# Altium project Nixie_clock.PrjPcb
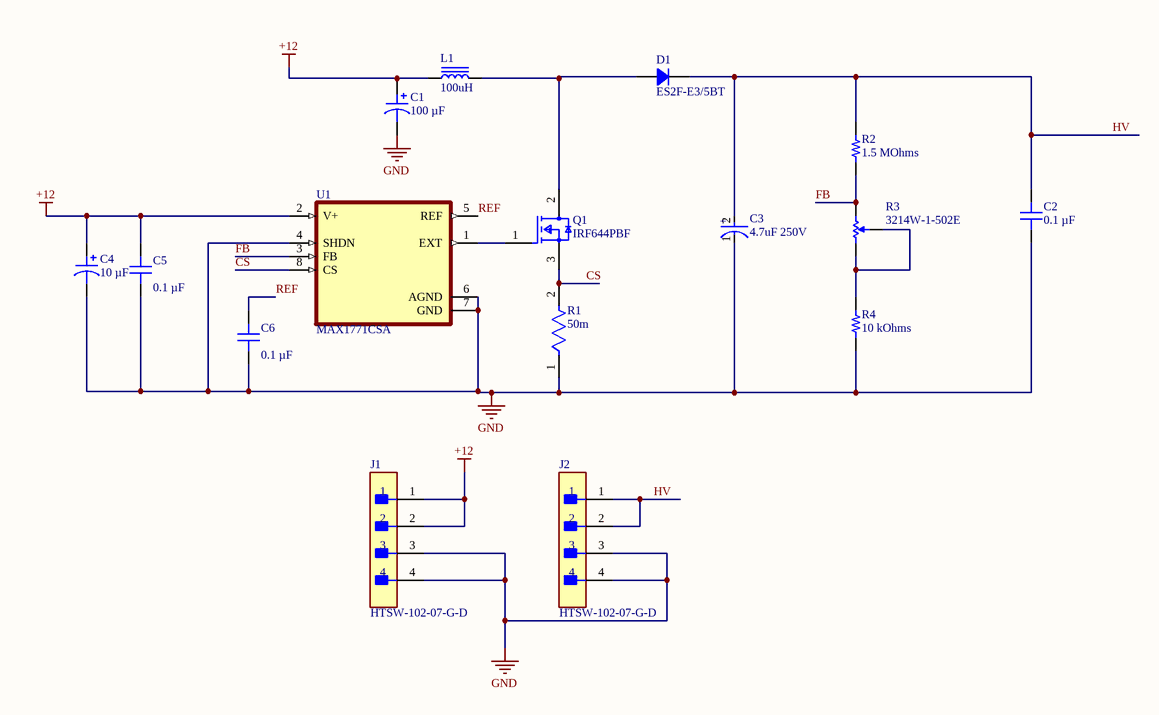
[diagram p0: HV.SchDoc]
1 sheet, 16 parts. Net scope: global (net labels, ports and power ports of the same name join across sheets).
Board file: HV_PCB.PcbDoc

## Sheet HV.SchDoc
size A4; SheetNumber: 1; SheetTotal: 1

### Parts
C1  value 100 µF  [CAP POL 2917_7343]  (hidden comment: 100uF)
C2  0.1 µF  [CAP 1206_3216 - 0.8MM]
C3  4.7uF 250V  [FP-RAD-TH-D_8_0_5-L_11_5-MFG]
C4  10 µF  [CAP POL 2917_7343]
C5  0.1 µF  [CAP 0402_1005]
C6  0.1 µF  [CAP 0402_1005]
D1  ES2F-E3/5BT  [DO214AA SMB]
J1  HTSW-102-07-G-D  [FP-HTSW-102-07-G-D-MFG]
J2  HTSW-102-07-G-D  [FP-HTSW-102-07-G-D-MFG]
L1  100uH  [BOURNS SRR1280]
Q1  IRF644PBF  [FP-E21-0621-MFG]
R1  50m  [FP-CSRN2010-MFG]
R2  1.5 MOhms  [RES 2512_6432]
R3  3214W-1-502E  [BOUR-3214W_V]
R4  10 kOhms  [RES 0805_2012]
U1  MAX1771CSA  [SOIC127P600X175-8N]

### Nets
+12: C1.1 C4.1 C5.2 J1.1 J1.2 L1.1 U1.2(V+)
GND: C1.2 C2.1 C3.1(C) C4.2 C5.1 C6.1 J1.3 J1.4 J2.3 J2.4 R1.1 R4.1 U1.4(SHDN) U1.6(AGND) U1.7(GND)
CS: Q1.3(S) R1.2 U1.8(CS)
FB: R2.1 R3.3 U1.3(FB)
HV: C2.2 C3.2(A) D1.2 J2.1 J2.2 R2.2
REF: C6.2 U1.5(REF)
NetD1_1: D1.1 L1.2 Q1.2(D)
NetQ1_1: Q1.1(G) U1.1(EXT)
NetR3_1: R3.1 R3.2 R4.2

### Notes on the sheet
- (in symbol CMP-05427-001567-1) +

### Library data of the parts
C1 = T495X106K035ATE200: TPSD107K020R0150; manufacturer: KEMET; Manufacturer Size Code: X; ESR (Equivalent Series Resistance): 200mOhm; Lifetime @ Temp.: 2000 Hrs @ 85°C; Tolerance: ±10%; Type: Molded; Voltage - Rated: 35 V; Part Number: T495X106K035ATE200; Capacitance: 100 µF; componentlink1description: Datasheet; componentlink1url: https://api.kemet.com/component-edge/download/datasheet/T495X106K035ATE200.pdf; componentlink2description: DigiKey Link; componentlink2url: https://www.digikey.com/en/products/detail/kemet/T495X106K035ATE200/3880123; Device Package: 2917 (7343 Metric); Features: General Purpose; Height - Seated (Max): 0.169" (4.30mm); lastupdated: 27.02.2023 20:44:53; Lifecycle Status: Active; Minimum Order: 1; Mounting Type: Surface Mount; Operating Temperature: -55°C ~ 125°C; Package / Case: 2917 (7343 Metric); packaging: TapeAndReel; partid: 772; Part Status: Active; price: 1.22; series: T495; Size / Dimension: 0.287" L x 0.169" W (7.30mm x 4.30mm); Supplier 1: DigiKey; Supplier Part Number 1: 399-10388-1-ND
C2 = CC1206KKX7RYBB104: CAP CER 0.1UF 250V X7R 1206; manufacturer: Yageo; Tolerance: ±10%; Part Number: CC1206KKX7RYBB104; Value: 0.1 µF; Applications: General Purpose; Capacitance: 0.1 µF; componentlink1description: Datasheet; componentlink1url: http://www.yageo.com/documents/recent/UPY-NP0X7R_MV_100-to-630V_21.pdf; componentlink2description: DigiKey Link; componentlink2url: https://www.digikey.com/en/products/detail/yageo/CC1206KKX7RYBB104/5195382; Device Package: 1206 (3216 Metric); lastupdated: 28.02.2023 20:14:01; Lifecycle Status: Active; Minimum Order: 1; Mounting Type: Surface Mount, MLCC; Operating Temperature: -55°C ~ 125°C; Package / Case: 1206 (3216 Metric); packaging: TapeAndReel; partid: 18767; Part Status: Active; price: 0.05; series: CC; Size / Dimension: 0.126" L x 0.063" W (3.20mm x 1.60mm); Supplier 1: DigiKey; Supplier Part Number 1: 311-1976-1-ND; Temperature Coefficient: X7R; Thickness (Max): 0.071" (1.80mm); Voltage - Rated: 250V
C3 = CMP-05427-001567-1: A759KS475M2EBAE496; Voltage Rating (DC): 200V; Life (Hours): 2000Hour; Lead/Base Style: Straight; Ripple Current: 50mA; Tolerance: 20%; Packaging: Tape and Reel; Termination: Radial; Height: 11.5mm; Lead Pitch: 5mm; Package Quantity: 1000; Voltage Rating: 200V; Series: NHG; Length: 11.5mm; Mount: Through Hole; Min Operating Temperature: -25°C; Max Operating Temperature: 105°C; RoHS Compliant: Yes; Diameter: 8mm; Case/Package: Radial; Radiation Hardening: No; Height - Seated (Max): 0.492inch; Capacitance: 4.7uF
C4 = T495X106K035ATE200: TPSD106K035R0300; manufacturer: KEMET; Manufacturer Size Code: X; ESR (Equivalent Series Resistance): 200mOhm; Lifetime @ Temp.: 2000 Hrs @ 85°C; Tolerance: ±10%; Type: Molded; Voltage - Rated: 35 V; Part Number: T495X106K035ATE200; Value: 10 µF; Capacitance: 10 µF; componentlink1description: Datasheet; componentlink1url: https://api.kemet.com/component-edge/download/datasheet/T495X106K035ATE200.pdf; componentlink2description: DigiKey Link; componentlink2url: https://www.digikey.com/en/products/detail/kemet/T495X106K035ATE200/3880123; Device Package: 2917 (7343 Metric); Features: General Purpose; Height - Seated (Max): 0.169" (4.30mm); lastupdated: 27.02.2023 20:44:53; Lifecycle Status: Active; Minimum Order: 1; Mounting Type: Surface Mount; Operating Temperature: -55°C ~ 125°C; Package / Case: 2917 (7343 Metric); packaging: TapeAndReel; partid: 772; Part Status: Active; price: 1.22; series: T495; Size / Dimension: 0.287" L x 0.169" W (7.30mm x 4.30mm); Supplier 1: DigiKey; Supplier Part Number 1: 399-10388-1-ND
C5 C6 = CGA2B3X7R1V104M050BB: CAP CER 0.1UF 35V X7R 0402; Part Number: CGA2B3X7R1V104M050BB; Value: 0.1 µF
D1 = ES2F-E3/5BT: DIODE GEN PURP 300V 2A DO214AA     ES2F-E3/52TVISHAY / TME; Part Number: ES2F-E3/5BT
J1 J2 = CMP-02766-000010-1: CONN HEADER VERT 4POS 2.54MM; Manufacturer: Samtec; Voltage Rating: 550V; Conn Orientation: Straight; Number Of Contacts: 4; Conn Gender: Male; Current Rating: 6.3A; Number Of Rows: 2; Category: Conn; Temperature: -55°C to +125°C; Automotive: No; Digikey Description: CONN HEADER VERT 4POS 2.54MM; ComponentLink2URL: http://suddendocs.samtec.com/catalog_english/htsw_th.pdf; Device Class L2: Headers and Wire Housings; Mouser Description: Conn Unshrouded Header HDR 4 POS 2.54mm Solder ST Thru-Hole Bag; Manufacturer Part Number: HTSW-102-07-G-D; Temperature Range High: +125°C; Contact Material: Gold,Nickel; Temperature Range Low: -55°C; ComponentLink2Description: Datasheet; Device Class L1: Connectors; Pitch: 2.54mm; Octopart: https://octopart.com/htsw-102-07-g-d-samtec-10531767; RoHS: TRUE; Package: HTSW-102-07-G-D; Lead Free: Yes; Device Class L3: unset; Height: 8.71mm
L1 = SRR1280-101M: FIXED IND 100UH 2.1A 150MOHM SMD; Part Number: SRR1280-101M
Q1 = CMP-02550-000289-1: N-MOSFET; unipolarny; 250V; 8,5A; 125W; TO220AB; Element Configuration: Single; Current Rating: 4.5A; Max Power Dissipation: 74W; Drain to Source Voltage (Vdss): 500V; Input Capacitance: 610pF; Fall Time: 16ns; On-State Resistance: 1.5R; Recovery Time: 640ns; Polarization: N; Polarity: N-CHANNEL; Number of Channels: 1; Turn-Off Delay Time: 42ns; Threshold Voltage: 4V; Gate to Source Voltage (Vgs): 20V; Turn-On Delay Time: 8.2ns; Min Operating Temperature: -55°C; Case/Package: TO-220AB; Weight: 0.211644oz; Mount: Through Hole; Drain-source On Resistance-Max: 1.5R; Width: 4.7mm; Voltage Rating (DC): 500V; Length: 10.41mm; Contact Plating: Tin; Max Operating Temperature: 150°C; Height: 9.01mm; Continuous Drain Current (ID): 4.5A; Drain to Source Breakdown Voltage: 500V; Number of Pins: 3; Radiation Hardening: No; Drain to Source Resistance: 1.5R; Power Dissipation: 74W; Number of Elements: 1; Package Quantity: 50; Packaging: Rail/Tube; Rds On Max: 1.5R; RoHS Compliant: Yes; Rise Time: 16ns; Lead Free: Lead Free; Nominal Vgs: 4V
R1 = CMP-26527-001458-1: Res Thick Film 2010 50mΩ 1% 1W ±250ppm/°C Molded SMD Plastic T/R; Resistance: 50mR; Number of Terminations: 2; Case/Package: 2010; Tolerance: 1%; Power Rating: 1W; RoHS Compliant: Yes; Max Power Dissipation: 1W; Radiation Hardening: No; Case Code (Metric): 5025; Max Operating Temperature: 155°C; Series: CSRN; Case Code (Imperial): 2010; Packaging: Tape and Reel; Mount: Surface Mount; Min Operating Temperature: -55°C; Height: 0.03inch; Temperature Coefficient: 250ppm/°C; Width: 0.097inch; Resistor Type: Thick Film; Lead Free: Lead Free; Length: 0.197inch; Contact Plating: Tin
R2 = ERJ-1TYJ155U: RES SMD 1.5M OHM 5% 1W 2512; Manufacturer: Panasonic Electronic Components; Temperature Coefficient: -400/ +150ppm/°C; Part Number: ERJ-1TYJ155U; ComponentLink1Description: Datasheet; ComponentLink1URL: https://b2b-api.panasonic.eu/file_stream/pids/fileversion/1242; ComponentLink2Description: DigiKey Link; ComponentLink2URL: http://digikey.com/product-detail/en/panasonic-electronic-components/ERJ-1TYJ155U/PT1.5MXCT-ND/365327; Composition: Thick Film; Device Package: 2512 (6432 Metric); Features: Automotive AEC-Q200; Height - Seated (Max): 0.028" (0.70mm); LastUpdated: 02.09.2020 01:26:52; Lifecycle Status: Active; Minimum Order: 1; Number of Terminations: 2; Operating Temperature: -55°C ~ 155°C; Package / Case: 2512 (6432 Metric); Packaging: TapeAndReel; Part Status: Active; Power (Watts): 1W; Price: 0.06; Ratings: AEC-Q200; Resistance: 1.5 MOhms; Series: ERJ; Size / Dimension: 0.252" L x 0.126" W (6.40mm x 3.20mm); Supplier 1: DigiKey; Supplier Part Number 1: PT1.5MXCT-ND; Supplier Device Package: 2512; Tolerance: ±5%; Value: 1.5 MOhms
R3 = CMP-2000-05579-1: 3214 - 5-Turn Trimpot(R) Trimming Potentiometer, 5 KOhm, +/- 10%, 0.25 W, -65 to 150 degC, RoHS, Tape and Reel; Manufacturer: Bourns; Temperature Coefficient: ±100ppm/°C; Power Rating: 250mW; No. of Turns: 5; Track Resistance: 5kohm; SVHC: NoSVHC(16-Jun-2014); Potentiometer Mounting: SMD; Manufacturer URL: http://www.bourns.com/; Resistance Tolerance: ±10%; Datasheet URL: http://www.bourns.com/docs/Product-Datasheets/3214.pdf; ROHS COMPLIANT: Yes; Mounting Technology: SurfaceMount; Datasheet Version: 05/2016; Package Reference: 3214W; Package Description: 3-Pin Surface Mount Device, Body 3.5 x 4.8 mm, Pitch 1.25 mm
R4 = CPF0805B10KE: RES SMD 10K OHM 0.1% 1/10W 0805; Manufacturer: TE Connectivity Passive Product; Power (Watts): 0.1W, 1/10W; Temperature Coefficient: ±25ppm/°C; Part Number: CPF0805B10KE; Value: 10 kOhms; ComponentLink1Description: Datasheet; ComponentLink1URL: https://www.te.com/commerce/DocumentDelivery/DDEController?Action=srchrtrv&DocNm=1773200&DocType=DS&DocLang=English; ComponentLink2Description: DigiKey Link; ComponentLink2URL: https://www.digikey.com/en/products/detail/te-connectivity-passive-product/CPF0805B10KE/2389790; Composition: Thin Film; Device Package: 0805 (2012 Metric); Height - Seated (Max): 0.026" (0.65mm); LastUpdated: 27.02.2023 20:43:05; Lifecycle Status: Active; Minimum Order: 1; Number of Terminations: 2; Operating Temperature: -55°C ~ 155°C; Package / Case: 0805 (2012 Metric); Packaging: TapeAndReel; PartId: 27724; Part Status: Active; Price: 0.10; Resistance: 10 kOhms; Series: CPF, Neohm; Size / Dimension: 0.079" L x 0.049" W (2.00mm x 1.25mm); Supplier 1: DigiKey; Supplier Part Number 1: A106043CT-ND; Supplier Device Package: 0805; Tolerance: ±0.1%
U1 = MAX1771CSA: Boost, Buck-Boost Regulator Positive Output Step-Up, Step-Up/Step-Down - DC-DC Controller IC 8-SOIC; MF: Maxim Integrated; Price: None; MP: MAX1771CSA; Purchase-URL: https://pricing.snapeda.com/search/part/MAX1771CSA/?ref=eda; Package: SOIC-8 Maxim; Check_prices: https://www.snapeda.com/parts/MAX1771CSA/Maxim+Integrated/view-part/?ref=eda; SnapEDA_Link: https://www.snapeda.com/parts/MAX1771CSA/Maxim+Integrated/view-part/?ref=snap; Availability: In Stock; Value: *